# Altium schematic sheet USB_BAT.SchDoc
size A4; SheetNumber: 3; SheetTotal: 4
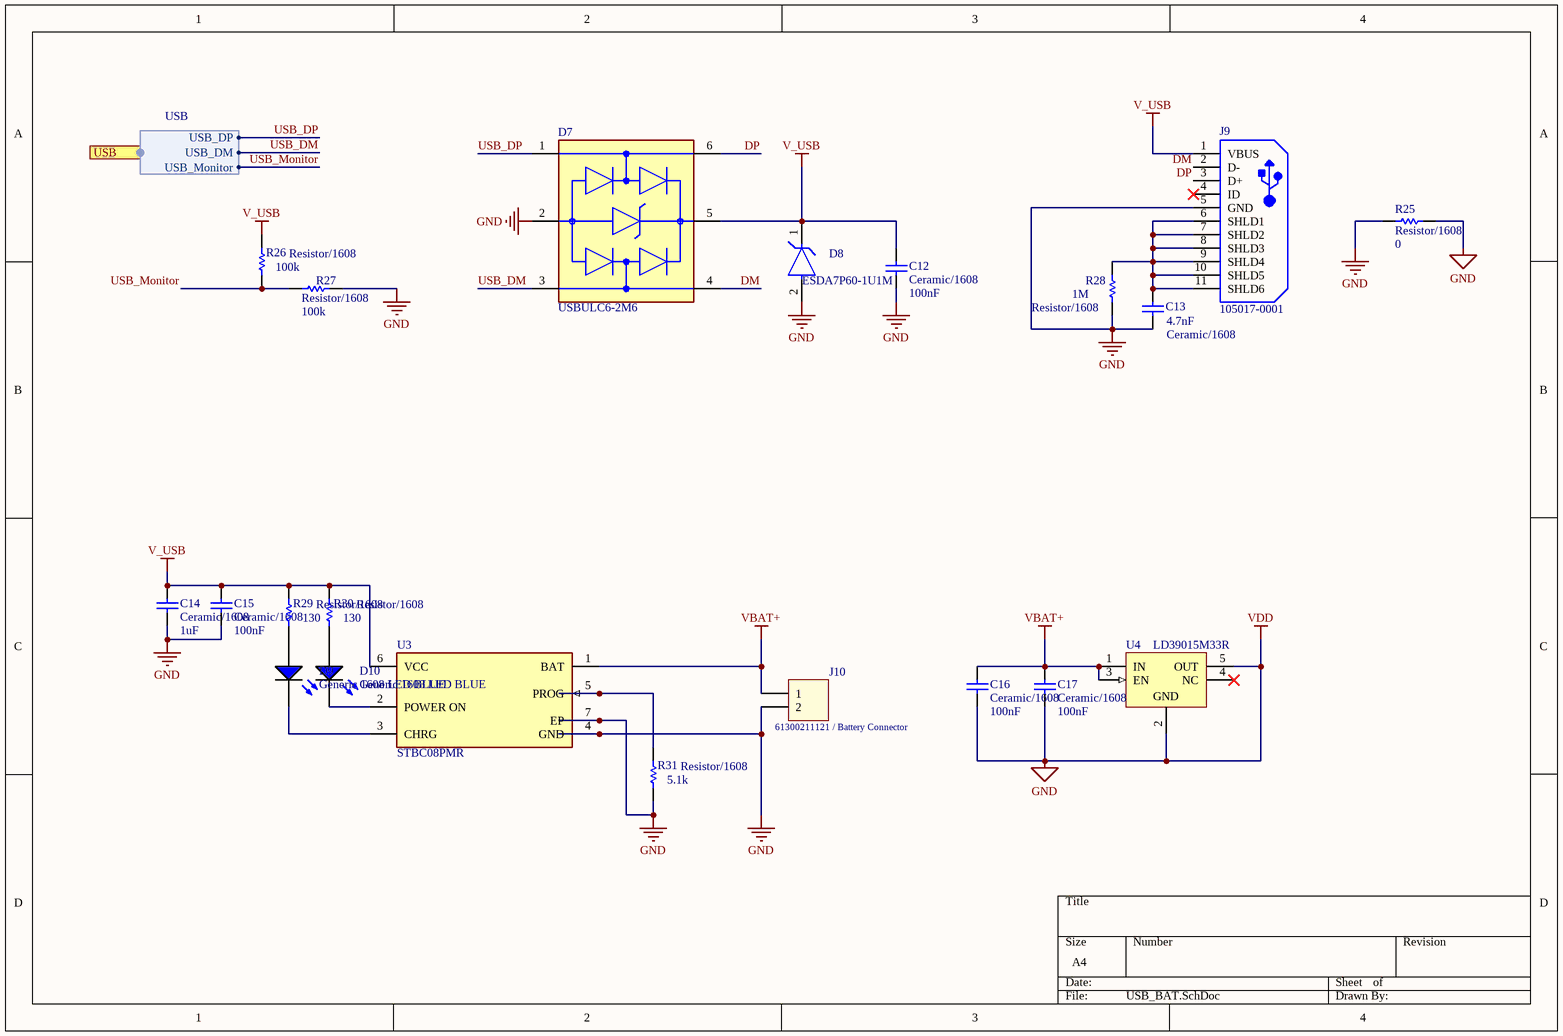
[diagram p0: USB_BAT.SchDoc]

## Parts
C12  Ceramic/1608  value 100nF  [Generic 1608 Ceramic]
C13  Ceramic/1608  value 4.7nF  [Generic 1608 Ceramic]
C14  Ceramic/1608  value 1uF  [Generic 1608 Ceramic]
C15  Ceramic/1608  value 100nF  [Generic 1608 Ceramic]
C16  Ceramic/1608  value 100nF  [Generic 1608 Ceramic]
C17  Ceramic/1608  value 100nF  [Generic 1608 Ceramic]
D7  USBULC6-2M6  [FP-QFN_1_45x1_00_6L-MFG]
D8  ESDA7P60-1U1M  [FP-1610-MFG]
D9  Generic 1608 LED BLUE  [Generic 1608 LED BLUE-Footprint-1]
D10  Generic 1608 LED BLUE  [Generic 1608 LED BLUE-Footprint-1]
J9  105017-0001  [USB-MICRO-B_V]
J10  61300211121 / Battery Connector  [61300211121]
R25  Resistor/1608  value 0  [Resistor 1608-Footprint]
R26  Resistor/1608  value 100k  [Resistor 1608-Footprint]
R27  Resistor/1608  value 100k  [Resistor 1608-Footprint]
R28  Resistor/1608  value 1M  [Resistor 1608-Footprint]
R29  Resistor/1608  value 130  [Resistor 1608-Footprint]
R30  Resistor/1608  value 130  [Resistor 1608-Footprint]
R31  Resistor/1608  value 5.1k  [Resistor 1608-Footprint]
U3  STBC08PMR  [FP-DFN6-7946637-IPC_A]
U4  LD39015M33R  [SOT23-5L_M]

## Ports
USB (harness USB)

## Harnesses
USB: USB_DM, USB_DP, USB_Monitor

## Nets
GND: C12.1 C13.1 C14.1 C15.1 C16.1 C17.1 D7.2 D8.2(A) J9.5(GND) J10.2 R25.1 R25.2 R27.1 R28.1 R31.1 U3.4(GND) U3.7(EP) U4.2(GND) U4.5(OUT)  [also labelled VDD]
V_USB: C12.2 C14.2 C15.2 D7.5 D8.1(C) J9.1(VBUS) R26.2 R29.2 R30.2 U3.6(VCC)
VBAT+: C16.2 C17.2 J10.1 U3.1(BAT) U4.1(IN) U4.3(EN)
DM: D7.4(I/O2) J9.2(D-)
DP: D7.6(I/O1) J9.3(D+)
USB_DM: D7.3(I/O2) ; port USB.USB_DM
USB_DP: D7.1(I/O1) ; port USB.USB_DP
USB_Monitor: R26.1 R27.2 ; port USB.USB_Monitor
NetC13_2: C13.2 J9.6(SHLD1) J9.7(SHLD2) J9.8(SHLD3) J9.9(SHLD4) J9.10(SHLD5) J9.11(SHLD6) R28.2
NetD9_1: D9.1(A) R29.1
NetD9_2: D9.2(K) U3.3(CHRG)
NetD10_1: D10.1(A) R30.1
NetD10_2: D10.2(K) U3.2(POWER_ON)
NetR31_2: R31.2 U3.5(PROG)

Not connected (* = marked no-connect by the designer): J9 4(ID)*; U4 4(NC)*

## Library data of the parts
C12 C14-C17 = CMP-002-0009-3: Generic 1608 Ceramic Capacitor; Capacitor Type: Ceramic; Pins: 2; Mount: SMD; Case/Package: 1608; RoHS: Yes
C13 = CMP-002-0009-3: Generic 1608 Ceramic Capacitor / 50V; Capacitor Type: Ceramic; Pins: 2; Mount: SMD; Case/Package: 1608; RoHS: Yes
D7 = CMP-12225-000002-1: TVS DIODE 5V 17V 6UQFN; Manufacturer: STMicroelectronics; Breakdown Voltage: 6V; Direction: Unidirectional; Capacitance: 0.65pF; Number Of Channels: 2; Max Junction Temp: +150°C; Value: 0.65pF; Standoff Height: 0mm; Package: QFN_1.45x1.00_6L; Digikey Description: TVS DIODE 5V 17V 6UQFN; Temperature Range High: +150°C; Device Class L2: TVS Diodes; ComponentLink2Description: Datasheet; Device Class L1: Circuit Protection; Temperature: to +150°C; RoHS: TRUE; Ipc Land Pattern Name: DFN145X100X57-6; Manufacturer Part Number: USBULC6-2M6; Category: Diode; Automotive: No; ComponentLink2URL: https://www.st.com/resource/en/datasheet/usbulc6-2m6.pdf; Lead Free: Yes; Device Class L3: unset; Clamping Voltage: 17V; Mouser Description: ESD Suppressors ULTRA LG BANDWIDTH ESD PROTECTION; Octopart: https://octopart.com/usbulc6-2m6-stmicroelectronics-7979994; Height: 0.65mm
D8 = CMP-12225-000013-1: TVS DIODE 5V 11.6V 1610; Manufacturer: STMicroelectronics; Number Of Channels: 1; Standoff Height: 0mm; Breakdown Voltage: 6.4V; Direction: Unidirectional; Clamping Voltage: 10.2V; Peak Pulse Power: 700W; Peak Pulse Current: 60A; Max Junction Temp: +150°C; ComponentLink2Description: Datasheet; Temperature Range Low: -55°C; Package: 1610; Lead Free: Yes; Temperature Range High: +150°C; Temperature: -55°C to +150°C; Device Class L2: TVS Diodes; Category: Diode; Device Class L1: Circuit Protection; Manufacturer Part Number: ESDA7P60-1U1M; Digikey Description: TVS DIODE 5V 11.6V 1610; ComponentLink2URL: http://www.st.com/content/ccc/resource/technical/document/datasheet/44/e9/26/44/42/ee/4f/e5/DM00139972.pdf/files/DM00139972.pdf/jcr:content/translations/en.DM00139972.pdf; Reverse Standoff Voltage: 5V; RoHS: TRUE; Octopart: https://octopart.com/esda7p60-1u1m-stmicroelectronics-52112702; Height: 0.65mm; Device Class L3: unset; Automotive: No
D9 D10 = CMP-008-0003-2: Generic 1608 LED <BLUE>
J9 = CMP-2000-05827-1: Micro-USB B Receptacle, Right Angle, Bottom Mount, Surface Mount, with Solder Tabs, -30 to 85 degC, 5-Pin USB, RoHS, Tape and Reel; Manufacturer: Molex; Featured Product: Micro-USBConnectorsUSBConnectors; Other Names: WM1399DKR; Package Version: Rev. F, 12/2012; Number of Contacts: 5; Connector Type: USB-microB; Catalog Drawings: 1050170001; 3D Model: 105017-0001.stp; Mating Products: WM17145-ND-CABLEMICROUSBBTOSTDA1.0MWM17147-ND-CABLEMICROUSBBTOSTDA2.0MWM17146-ND-CABLEMICROUSBBTOSTDA1.5M; PCN Assembly/Origin: ResinSupplier21/Oct/2015; Voltage - Max: 30V; Online Catalog: Molex-MicroUSB; Manufacturer URL: http://www.molex.com/; Package Description: 5-Leads USB, Micro B, Body 7.5 x 5 mm, Pitch 0.65 mm; Datasheet URL: http://www.molex.com/elqNow/elqRedir.htm?ref=http://www.molex.com/webdocs/datasheets/pdf/en-us/1050170001_IO_CONNECTORS.pdf; Ingress Protection: -; Datasheet Version: 03/2016; Mounting Type: BoardCutout,SurfaceMount,RightAngle; Circuits: 5; Standard Package: 1; Package Reference: MICRO-B; Package URL: http://www.molex.com/pdm_docs/sd/1050170001_sd.pdf; Category: Connectors,Interconnects; Series: -; RoHS Information: 1050170001CertofCompliance; Features: Shielded,SolderRetention; Family: USB,DVI,HDMIConnectors; Specifications: -; Gender: Receptacle; Packaging: Digi-Reel®; Mounting Technology: SurfaceMount
J10 = CMP-005-0052-1: Pin Header WR-PHD, pitch 2.54 mm, THT, Vertical, single row, 2 pin; Contact Resistance: 20 mOhm; Insulation Resistance: >1000 MOhm; Pin Number: 2; Pitch: 2.54 mm; Rated Current: 3 A; Working Voltage: 250 VAC; Component Name: 61300211121; ComponentLink1Description: Manufacturer; ComponentLink1URL: http://www.we-online.de; ComponentLink2Description: Datasheet; ComponentLink2URL: http://katalog.we-online.de/em/datasheet/6130xx11121.pdf; Designator: 61300211121; Mounting Technology: THT; Operating Temperature: -40 to 105 degC; Orientation: Vertical; Part Number: 61300211121; Pin Count: 2; Published Date: Jan. 2018; Publisher: Wurth Elektronik; Row Number: Single
R25-R31 = CMP-001-0018-2: Generic 1608 Resistor; Pins: 2; Case/Package: Bulk; RoHS: Yes; Mount: SMD
U3 = CMP-12147-000003-2: IC BATT CHRGR LI-ION 800MA DFN6; Max Input Voltage: 10V; Min Supply Voltage: 4.25V; Min Output Voltage: 4.158V; Max Output Voltage: 4.242V; Number of Channels: 1; Max Supply Voltage: 6.5V; Output Voltage: 4.2V; Case/Package: DFN; Length: 3.1mm; Width: 3.1mm; Packaging: Tape and Reel; Output Current: 800mA; Min Operating Temperature: -40°C; Mount: Surface Mount; Height: 0.95mm; Radiation Hardening: No; Lead Free: Lead Free; Max Output Current: 800mA; Max Operating Temperature: 85°C; Number of Pins: 6; Package Quantity: 1
U4 = CMP-0244-00351-1: 150 mA Low Quiescent Current Low Noise Voltage Regulator, 3.3V, 5-Pin SOT-23, Tape and Reel; PackageReference: SOT23-5L; ComponentLink1URL: http://www.st.com; PackageDescription: 5-Pin SOT-23 Package, 2.9 x 1.6 mm Body, 0.95 mm Pitch, 2.8 mm Lead Span; ComponentLink2Description: Datasheet; DatasheetVersion: 1/02/2009; ComponentLink1Description: Manufacturer URL; ComponentLink2URL: http://www.st.com/internet/com/TECHNICAL_RESOURCES/TECHNICAL_LITERATURE/DATASHEET/CD00173477.pdf; PackageVersion: 1/01/2008